# Altium schematic sheet ESP32_Module.SchDoc: Title
size A4; Date: *******; ApprovedBy: *******; CheckedBy: None; Author: *******; CompanyName: *******; DrawnBy: Name; Engineer: *******; Organization: *******; Address1: *******; Address2: *******; Address3: *******; Address4: *******; DocumentNumber: 5; Revision: *******; SheetNumber: 5; SheetTotal: 11; CurrentTime: *******; CurrentDate: *******; Time: *******; DocumentFullPathAndName: *******; DocumentName: *******; ModifiedDate: *******; ImagePath: *******; ProjectName: *******; Application_BuildNumber: *******
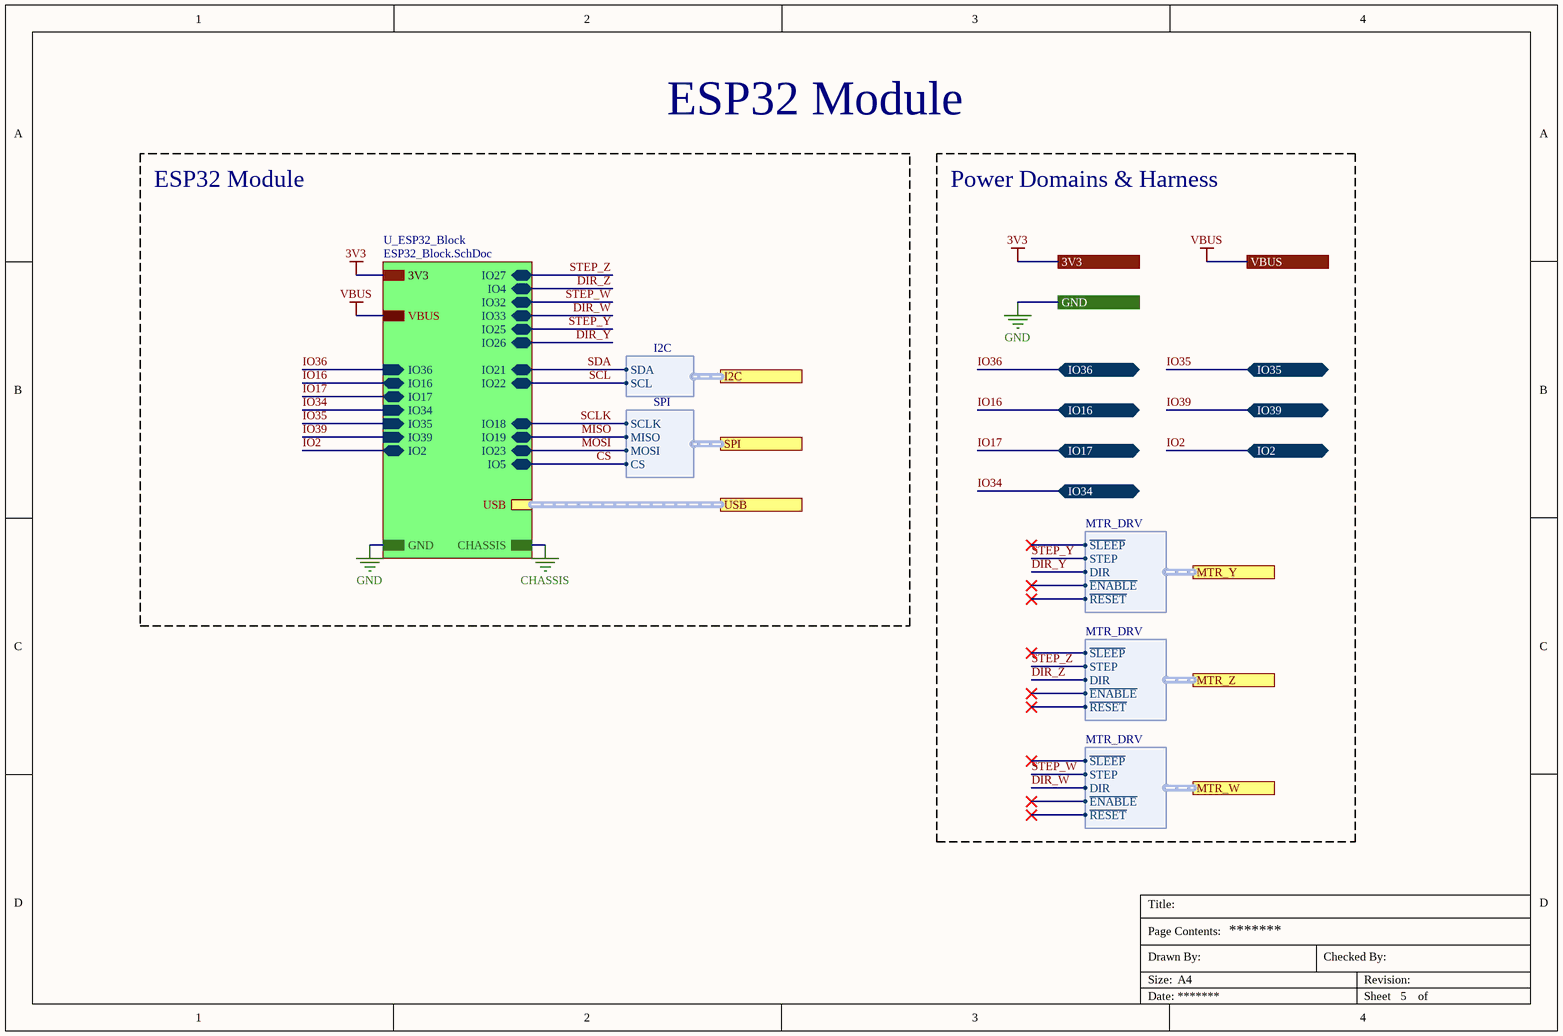
[diagram p0: ESP32_Module.SchDoc]

## Sub-sheets
U_ESP32_Block = ESP32_Block.SchDoc: IO34 (in), IO35 (in), IO32 (bidir), IO33 (bidir), IO25 (bidir), IO26 (bidir), IO27 (bidir), IO2 (bidir), IO4 (bidir), IO16 (bidir), IO17 (bidir), IO5 (bidir), IO18 (bidir), IO19 (bidir), IO21 (bidir), IO22 (bidir), IO23 (bidir), IO36 (in), IO39 (in), 3V3, GND, CHASSIS, VBUS, USB (harness USB)

## Ports
3V3 (see Lens-Maker[2A], A4988[3B], ESP32_Block[3C], GPIO_Header[3B], I2C_Header[3B], Power[3B], SPI_Header[3B], Stepper_Driver[3A]), GND (see Lens-Maker[2D], A4988[3B], ESP32_Block[3D], GPIO_Header[3B], I2C_Header[3B], Mechanical_Holes[3B], Power[3C], SPI_Header[3B], Stepper_Driver[3B], USB_Connector[3B]), I2C (harness I2C, see Lens-Maker[2B], I2C_Header[3C]), IO2 (bidir, see Lens-Maker[2C], ESP32_Block[4C]), IO16 (bidir, see Lens-Maker[2C], ESP32_Block[4C]), IO17 (bidir, see Lens-Maker[2C], ESP32_Block[4C]), IO34 (bidir, see Lens-Maker[2C], ESP32_Block[3C]), IO35 (bidir, see Lens-Maker[2C], ESP32_Block[3C]), IO36 (bidir, see Lens-Maker[2C], ESP32_Block[4C]), IO39 (bidir, see Lens-Maker[2C], ESP32_Block[4D]), MTR_W (harness MTR_DRV, see Lens-Maker[2B]), MTR_Y (harness MTR_DRV, see Lens-Maker[2B]), MTR_Z (harness MTR_DRV, see Lens-Maker[2B]), SPI (harness SPI, see Lens-Maker[2C], SPI_Header[3C]), USB (harness USB, see Lens-Maker[2B], ESP32_Block[3C], USB_Connector[3C]), VBUS (see Lens-Maker[2B], ESP32_Block[3C], Power[3B], USB_Connector[3B])

## Harnesses
I2C: SDA, SCL
SPI: SCLK, MISO, MOSI, CS
MTR_DRV: ~{SLEEP}, STEP, DIR, ~{ENABLE}, ~{RESET}

## Nets
3V3: port 3V3, sheet U_ESP32_Block/3V3
CHASSIS: sheet U_ESP32_Block/CHASSIS
GND: port GND, sheet U_ESP32_Block/GND
VBUS: port VBUS, sheet U_ESP32_Block/VBUS
CS: sheet U_ESP32_Block/IO5, port SPI.CS
DIR_W: sheet U_ESP32_Block/IO33, port MTR_W.DIR
DIR_Y: sheet U_ESP32_Block/IO26, port MTR_Y.DIR
DIR_Z: sheet U_ESP32_Block/IO4, port MTR_Z.DIR
IO2: port IO2, sheet U_ESP32_Block/IO2
IO16: port IO16, sheet U_ESP32_Block/IO16
IO17: port IO17, sheet U_ESP32_Block/IO17
IO34: port IO34, sheet U_ESP32_Block/IO34
IO35: port IO35, sheet U_ESP32_Block/IO35
IO36: port IO36, sheet U_ESP32_Block/IO36
IO39: port IO39, sheet U_ESP32_Block/IO39
MISO: sheet U_ESP32_Block/IO19, port SPI.MISO
MOSI: sheet U_ESP32_Block/IO23, port SPI.MOSI
SCL: sheet U_ESP32_Block/IO22, port I2C.SCL
SCLK: sheet U_ESP32_Block/IO18, port SPI.SCLK
SDA: sheet U_ESP32_Block/IO21, port I2C.SDA
STEP_W: sheet U_ESP32_Block/IO32, port MTR_W.STEP
STEP_Y: sheet U_ESP32_Block/IO25, port MTR_Y.STEP
STEP_Z: sheet U_ESP32_Block/IO27, port MTR_Z.STEP

## Buses and harness runs
harness port USB = sheet U_ESP32_Block/USB

## Notes on the sheet
- ESP32 Module
- Power Domains & Harness
- Title:
- Size:
- Date:
- Drawn By:
- Page Contents:
- A4
- Checked By:
- Revision:
- Sheet
- of